# EAGLE schematic final_schematic (EAGLE 9.6.2)
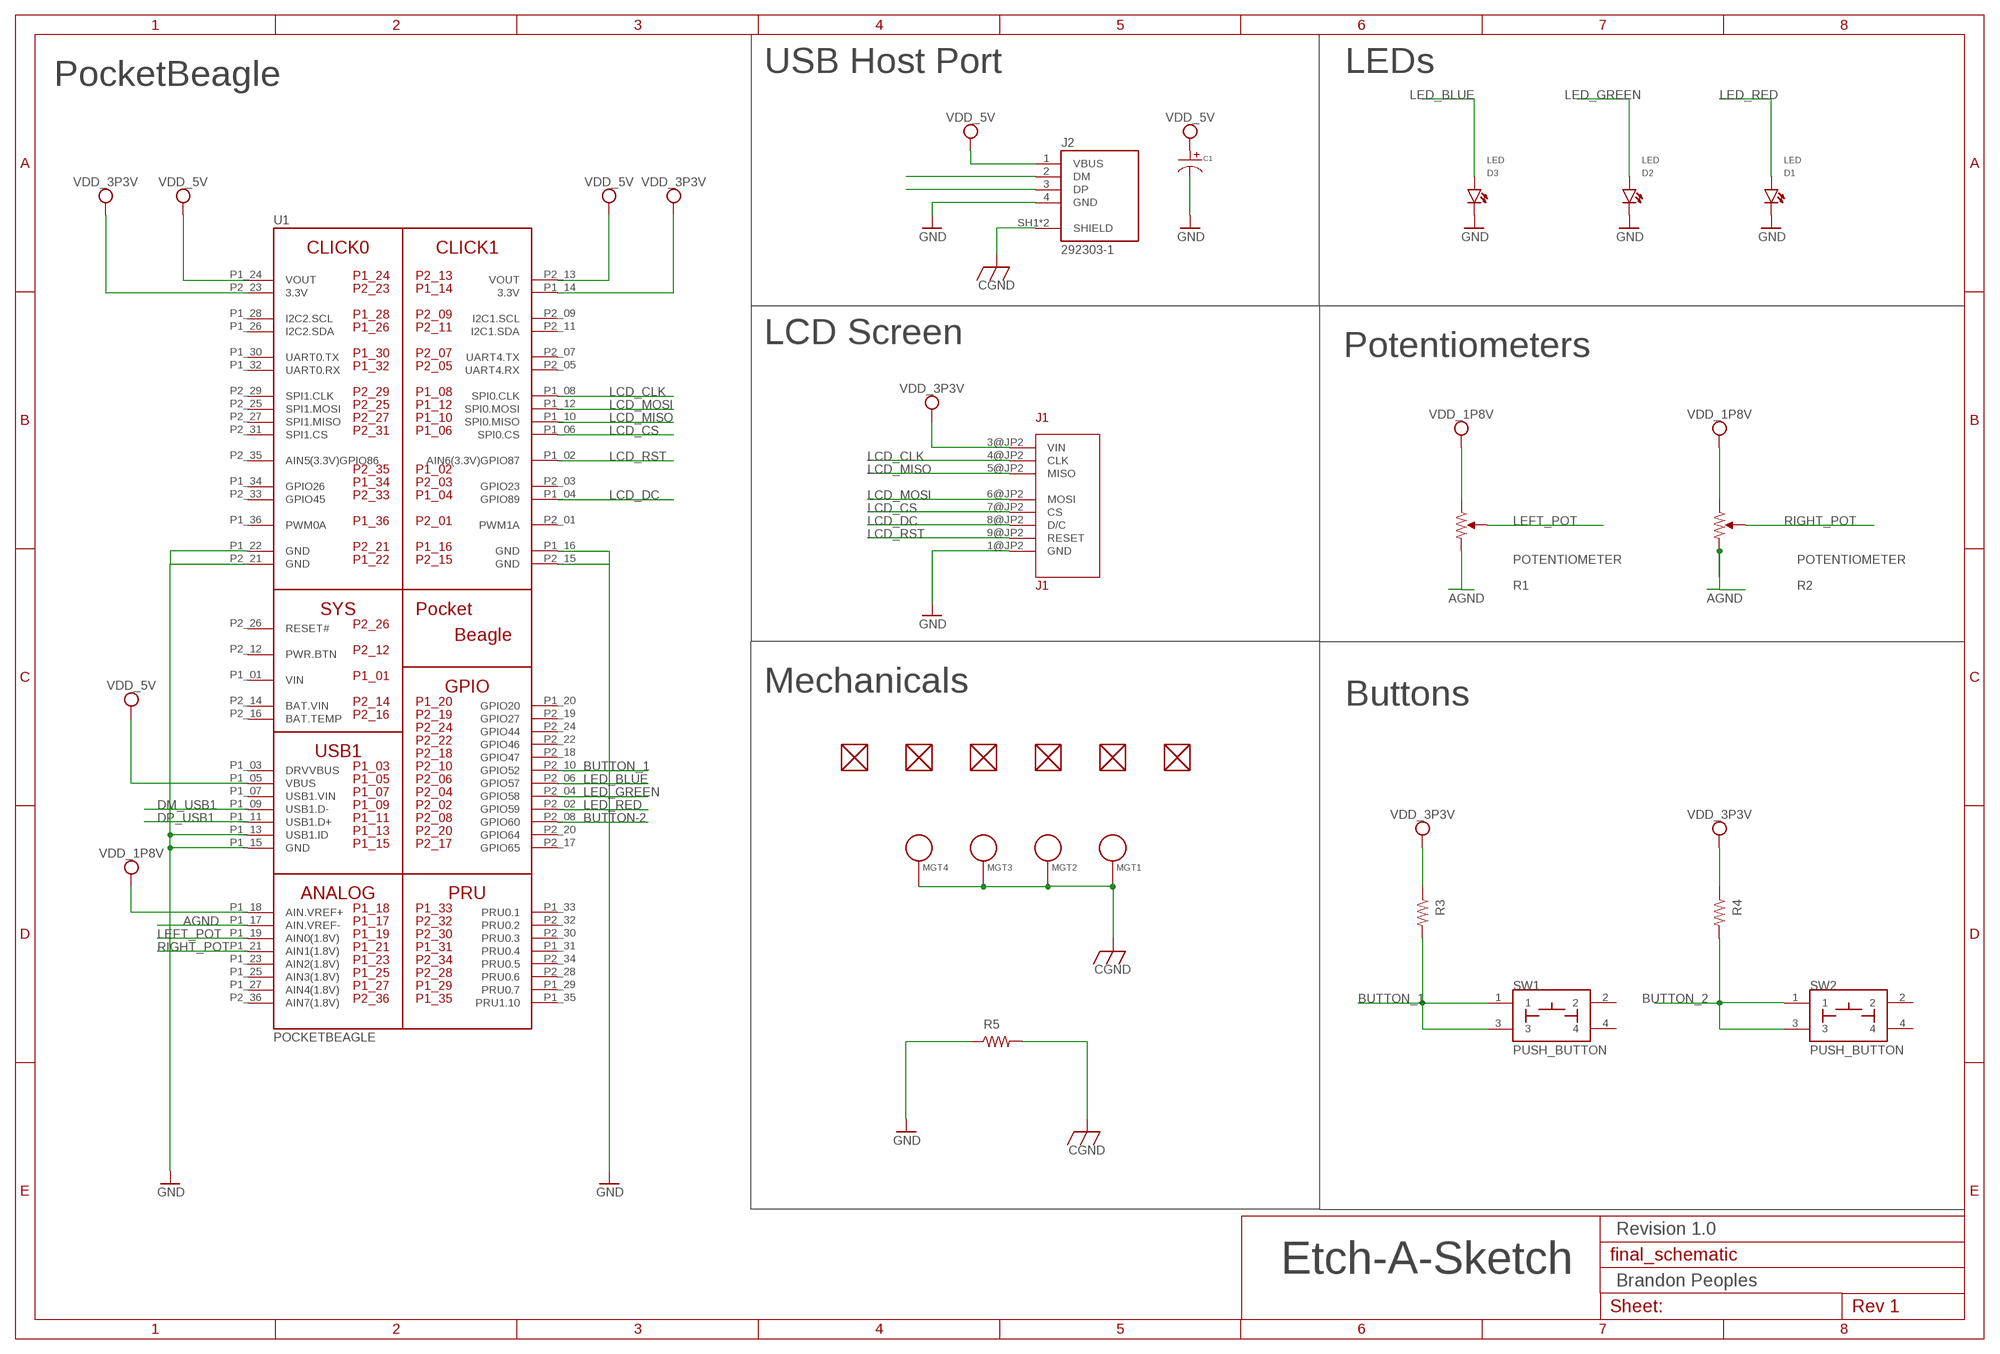
[diagram p0: schematic, sheet 1]

## Parts
C1  CAPACITOR_P_10MM  [CP10MM]
D1  LED  [EIA-STD]
D2  LED  [EIA-STD]
D3  LED  [EIA-STD]
FUD1  FIDUCIAL  [FIDUCIAL_40MIL]
FUD2  FIDUCIAL  [FIDUCIAL_40MIL]
FUD4  FIDUCIAL  [FIDUCIAL_40MIL]
FUD5  FIDUCIAL  [FIDUCIAL_40MIL]
FUD6  FIDUCIAL  [FIDUCIAL_40MIL]
FUD7  FIDUCIAL  [FIDUCIAL_40MIL]
J1  LCD  [TFT_LCD_PCB]
J2  292303-1  [TE_292303-1]
MGT1  MOUNTING_HOLE  [MOUNTING_HOLE]
MGT2  MOUNTING_HOLE  [MOUNTING_HOLE]
MGT3  MOUNTING_HOLE  [MOUNTING_HOLE]
MGT4  MOUNTING_HOLE  [MOUNTING_HOLE]
R1  POTENTIOMETER  [POT-PO90S]
R2  POTENTIOMETER  [POT-PO90S]
R3  R_R0402  [R0402]
R4  R_R0402  [R0402]
R5  R_R0402  [R0402]
SW1  PUSH_BUTTON  [BUTTON_12.5MM]
SW2  PUSH_BUTTON  [BUTTON_12.5MM]
U1  POCKETBEAGLE  [POCKETBEAGLE]

## Nets
AGND: R1.CW R2.CW U1.P1_17(AIN.VREF-)
BUTTON-2: U1.P2_08(GPIO60)
BUTTON_1: R3.2 SW1.1 SW1.3 U1.P2_10(GPIO52)
BUTTON_2: R4.2 SW2.1 SW2.3
CGND: J2.SH1(SHIELD) J2.SH2(SHIELD) MGT1.P$1 MGT2.P$1 MGT3.P$1 MGT4.P$1 R5.2
GND: C1.P$2 D1.CATHODE D2.CATHODE D3.CATHODE J1.1@JP2(GND) J2.4(GND) R5.1 U1.P1_13(USB1.ID) U1.P1_15(GND) U1.P1_16(GND) U1.P1_22(GND) U1.P2_15(GND) U1.P2_21(GND)
LCD_CLK: J1.4@JP2(CLK) U1.P1_08(SPI0.CLK)
LCD_CS: J1.7@JP2(CS) U1.P1_06(SPI0.CS)
LCD_DC: J1.8@JP2(D/C) U1.P1_04(GPIO89)
LCD_MISO: J1.5@JP2(MISO) U1.P1_10(SPI0.MISO)
LCD_MOSI: J1.6@JP2(MOSI) U1.P1_12(SPI0.MOSI)
LCD_RST: J1.9@JP2(RESET) U1.P1_02(AIN6(3.3V)GPIO87)
LED_BLUE: D3.ANODE U1.P2_06(GPIO57)
LED_GREEN: D2.ANODE U1.P2_04(GPIO58)
LED_RED: D1.ANODE U1.P2_02(GPIO59)
LEFT_POT: R1.S U1.P1_19(AIN0(1.8V))
N$1: J2.2(DM)
N$2: U1.P1_09(USB1.D-)
N$3: U1.P1_11(USB1.D+)
N$4: J2.3(DP)
RIGHT_POT: R2.S U1.P1_21(AIN1(1.8V))
VDD_1P8V: R1.CCW R2.CCW U1.P1_18(AIN.VREF+)
VDD_3P3V: J1.3@JP2(VIN) R3.1 R4.1 U1.P1_14(3.3V) U1.P2_23(3.3V)
VDD_5V: C1.P$1 J2.1(VBUS) U1.P1_05(VBUS) U1.P1_24(VOUT) U1.P2_13(VOUT)
Unconnected: FUD1.P$1 FUD2.P$1 FUD4.P$1 FUD5.P$1 FUD6.P$1 FUD7.P$1 SW1.2 SW1.4 SW2.2 SW2.4 U1.P1_03(DRVVBUS) U1.P1_07(USB1.VIN) U1.P1_20(GPIO20) U1.P1_23(AIN2(1.8V)) U1.P1_25(AIN3(1.8V)) U1.P1_26(I2C2.SDA) U1.P1_27(AIN4(1.8V)) U1.P1_28(I2C2.SCL) U1.P1_29(PRU0.7) U1.P1_30(UART0.TX) U1.P1_31(PRU0.4) U1.P1_32(UART0.RX) U1.P1_33(PRU0.1) U1.P1_34(GPIO26) U1.P1_35(PRU1.10) U1.P1_36(PWM0A) U1.P2_01(PWM1A) U1.P2_03(GPIO23) U1.P2_05(UART4.RX) U1.P2_07(UART4.TX) U1.P2_09(I2C1.SCL) U1.P2_11(I2C1.SDA) U1.P2_12(PWR.BTN) U1.P2_16(BAT.TEMP) U1.P2_17(GPIO65) U1.P2_18(GPIO47) U1.P2_19(GPIO27) U1.P2_20(GPIO64) U1.P2_22(GPIO46) U1.P2_24(GPIO44) U1.P2_25(SPI1.MOSI) U1.P2_26(RESET#) U1.P2_27(SPI1.MISO) U1.P2_28(PRU0.6) U1.P2_29(SPI1.CLK) U1.P2_30(PRU0.3) U1.P2_31(SPI1.CS) U1.P2_32(PRU0.2) U1.P2_33(GPIO45) U1.P2_34(PRU0.5) U1.P2_35(AIN5(3.3V)GPIO86) U1.P2_36(AIN7(1.8V))

## Notes on the sheet
- USB Host Port | LEDs
- PocketBeagle
- Potentiometers
- LCD Screen
- Mechanicals
- Buttons
- DM_USB1
- DP_USB1
- Revision 1.0
- Etch-A-Sketch
- Brandon Peoples

## Power pins joined to a net without a drawn wire
BAT.VIN: U1.P2_14(BAT.VIN)
VIN: U1.P1_01(VIN)

## Library data of the parts
C1 = combo_lock:CAPACITOR_P: Library: MF_Passives Description: Device for Polarized Capacitors. Manufacture part number (MPN), Voltage Rating, and Tolerance can be added via Attributes. Check https://factory.macrofab.com/parts for the house parts list.; POPULATE: 1
D1-D3 = combo_lock:LED: EIA-STD LED, LTST-C191TBKT
FUD1 FUD2 FUD4-FUD7 = combo_lock:FIDUCIAL
J1 = lcd:LCD
J2 = combo_lock:292303-1: CONN USB RECEPT R/A TYPE A 4POS Check availability <https://pricing.snapeda.com/parts/292303-1/TE%20Connectivity/view-part?ref=eda>; AVAILABILITY: In Stock; CENTERLINE_PITCH: 2 mm[.078 in]; COMMENT: 292303-1; DESCRIPTION: Conn; Data; USB; Recept; 2.0; 4 Pos; 1 Port; Rt Angle; A Ser; Tin over Copper; EU_ROHS_COMPLIANCE: Compliant; MF: TE Connectivity; MP: 292303-1; NUMBER_OF_POSITIONS: 4; PACKAGE: None; PRICE: None; PRODUCT_TYPE: Connector; PURCHASE-URL: https://pricing.snapeda.com/search/part/292303-1/?ref=eda
MGT1-MGT4 = combo_lock:MOUNTING_HOLE: Chassis Mounting Hole w/GND connection ability
R1 R2 = combo_lock:POTENTIOMETER: Potentiometer - Examples: P090S-14T20BR10K (987-1277-ND)
R3-R5 = combo_lock:R_: RESISTOR, American symbol
SW1 SW2 = combo_lock:PUSH_BUTTON
U1 = combo_lock:POCKETBEAGLE